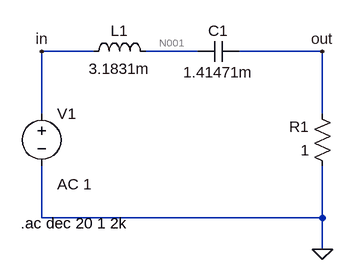
[diagram p0: schematic Sreies RLC Bandpass Filter.asc]
Sreies RLC Bandpass Filter.asc, the LTspice schematic file:
Version 4
SHEET 1 880 680
WIRE 112 96 32 96
WIRE 272 96 192 96
WIRE 464 96 336 96
WIRE 32 192 32 96
WIRE 464 192 464 96
WIRE 32 352 32 272
WIRE 464 352 464 272
WIRE 464 352 32 352
WIRE 464 400 464 352
FLAG 464 96 out
FLAG 464 400 0
FLAG 32 96 in
SYMBOL res 480 288 R180
WINDOW 0 36 76 Left 2
WINDOW 3 36 40 Left 2
SYMATTR InstName R1
SYMATTR Value 1
SYMBOL cap 336 80 R90
WINDOW 0 0 32 VBottom 2
WINDOW 3 32 32 VTop 2
SYMATTR InstName C1
SYMATTR Value 1.41471m
SYMBOL ind 96 112 R270
WINDOW 0 32 56 VTop 2
WINDOW 3 5 56 VBottom 2
SYMATTR InstName L1
SYMATTR Value 3.1831m
SYMBOL voltage 32 176 R0
WINDOW 123 24 124 Left 2
WINDOW 39 0 0 Left 0
SYMATTR Value2 AC 1
SYMATTR InstName V1
SYMATTR Value ""
TEXT 0 360 Left 2 !.ac dec 20 1 2k

The netlist it stands for:
* Sreies RLC Bandpass Filter.asc
R1 0 out 1
C1 out N001 1.41471m
L1 in N001 3.1831m
V1 in 0 AC 1
.ac dec 20 1 2k
.backanno
.end

* Results of the author's LTspice run, read from the files saved beside the schematic
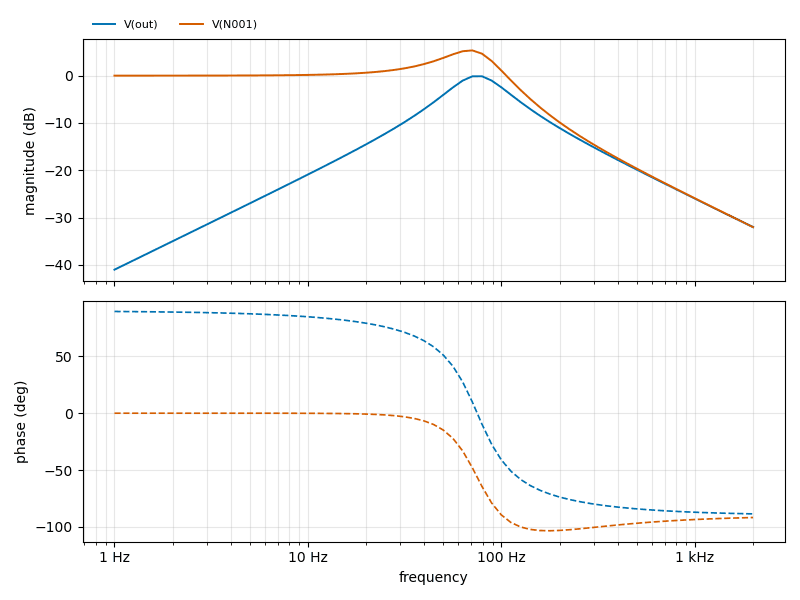
[diagram p1: AC Analysis of Sreies RLC Bandpass Filter.asc, plotted from the saved traces]
* AC Analysis, 1 run:
*   V(out): -41.02 dB at 1 Hz, -32.03 dB at 2 kHz, peak -0.14 dB at 79.43 Hz, 3 dB below the peak at 53.56 Hz and 105 Hz
*   V(N001): 0.00 dB at 1 Hz, -32.02 dB at 2 kHz, peak 5.34 dB at 70.79 Hz, 3 dB below the peak at 38.74 Hz and 93.12 Hz